# Altium schematic sheet MCU-system.SchDoc
size A4
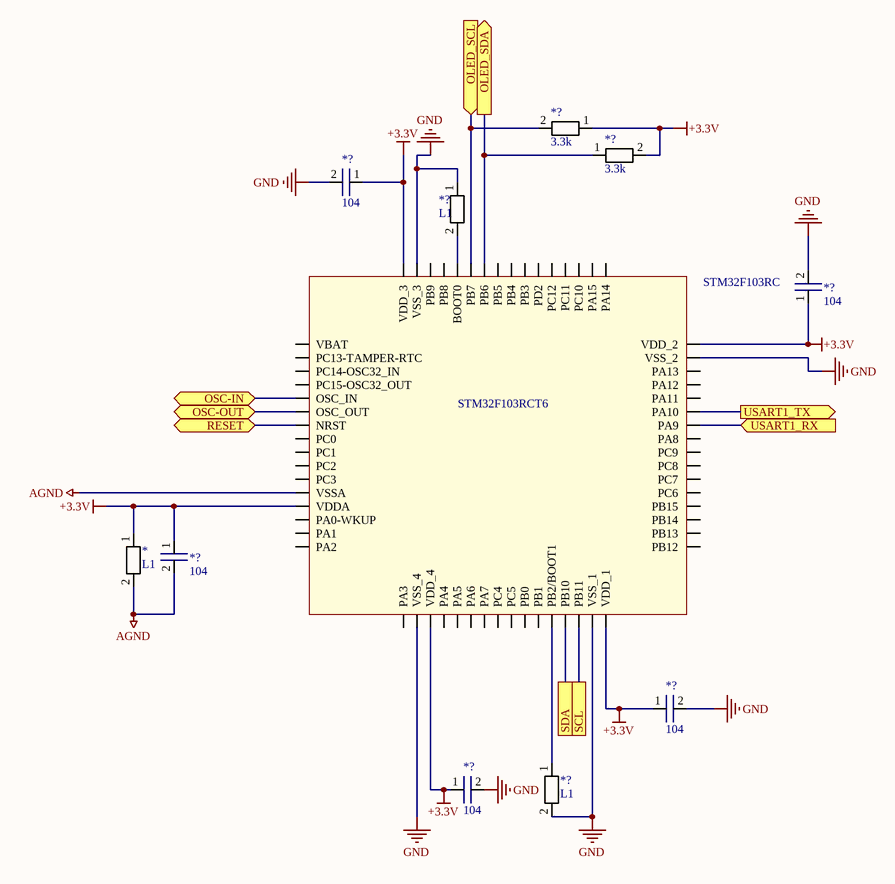
[diagram p0: MCU-system.SchDoc]

## Parts
(Parts that share a designator on the sheet are numbered #1, #2 ... from top to bottom, then left to right.)
*  L1  [R_SMD_0603]
*?#1  3.3k  [R_SMD_0603]
*?#2  3.3k  [R_SMD_0603]
*?#3  104  [C_SOP_0603]
*?#4  L1  [R_SMD_0603]
*?#5  104  [C_SOP_0603]
*?#6  104  [C_SOP_0603]
*?#7  104  [C_SOP_0603]
*?#8  104  [C_SOP_0603]
*?#9  L1  [R_SMD_0603]
?  STM32F103RC  [LQFP_64_10X10]

## Ports
OLED_SCL (in), OLED_SDA (out), OSC-IN (bidir), OSC-OUT (bidir), RESET (bidir), SCL, SDA, USART1_RX (in), USART1_TX (out)

## Nets
+3.3V: *.1 *?#1.1 *?#2.2 *?#3.1 *?#5.1 *?#6.1 *?#7.1 *?#8.1 ?.13(VDDA) ?.19(VDD_4) ?.32(VDD_1) ?.48(VDD_2) ?.64(VDD_3)
AGND: *.2 *?#6.2 ?.12(VSSA)
GND: *?#3.2 *?#4.1 *?#5.2 *?#7.2 *?#8.2 *?#9.2 ?.18(VSS_4) ?.31(VSS_1) ?.47(VSS_2) ?.63(VSS_3)
OLED_SCL: *?#1.2 ?.59(PB7) ; port OLED_SCL
OLED_SDA: *?#2.1 ?.58(PB6) ; port OLED_SDA
OSC-IN: ?.5(OSC_IN) ; port OSC-IN
OSC-OUT: ?.6(OSC_OUT) ; port OSC-OUT
RESET: ?.7(NRST) ; port RESET
SCL: ?.30(PB11) ; port SCL
SDA: ?.29(PB10) ; port SDA
USART1_RX: ?.42(PA9) ; port USART1_RX
USART1_TX: ?.43(PA10) ; port USART1_TX
Net*?#4_2: *?#4.2 ?.60(BOOT0)
Net*?#9_1: *?#9.1 ?.28(PB2/BOOT1)

Not connected (* = marked no-connect by the designer): ? 1(VBAT) 2(PC13-TAMPER-RTC) 3(PC14-OSC32_IN) 4(PC15-OSC32_OUT) 8(PC0) 9(PC1) 10(PC2) 11(PC3) 14(PA0-WKUP) 15(PA1) 16(PA2) 17(PA3) 20(PA4) 21(PA5) 22(PA6) 23(PA7) 24(PC4) 25(PC5) 26(PB0) 27(PB1) 33(PB12) 34(PB13) 35(PB14) 36(PB15) 37(PC6) 38(PC7) 39(PC8) 40(PC9) 41(PA8) 44(PA11) 45(PA12) 46(PA13) 49(PA14) 50(PA15) 51(PC10) 52(PC11) 53(PC12) 54(PD2) 55(PB3) 56(PB4) 57(PB5) 61(PB8) 62(PB9)

## Notes on the sheet
- (in symbol STM32F103RC) STM32F103RCT6

## Library data of the parts
* *?#1 *?#2 *?#4 *?#9 = R_SMD
*?#3 *?#5-*?#8 = C_SMD